# Altium schematic sheet ESP32xx.SchDoc
size OrCAD B
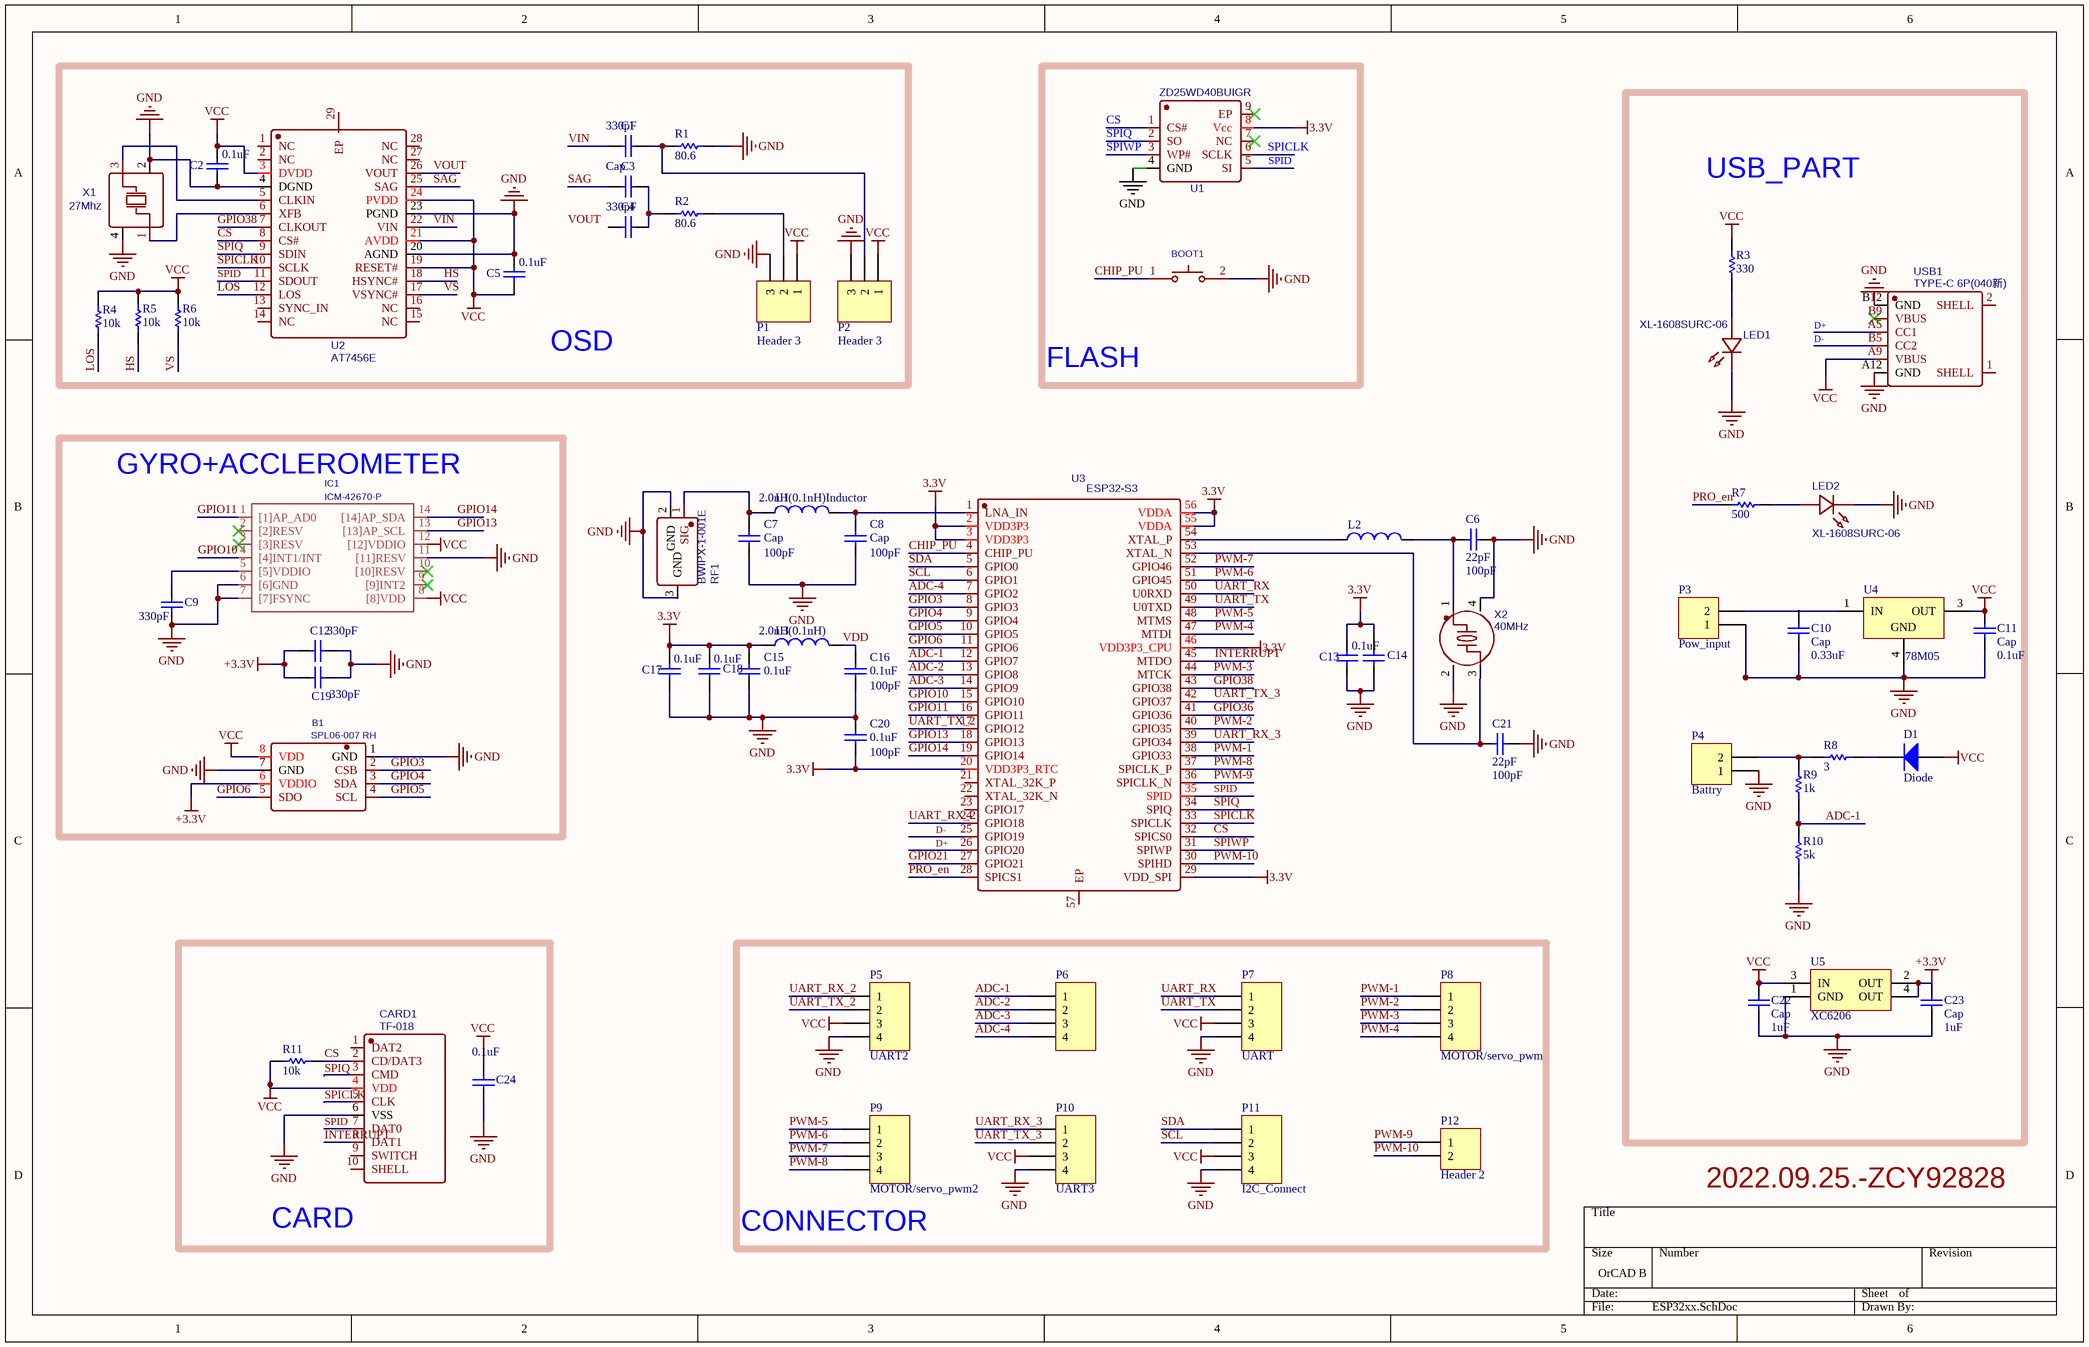
[diagram p0: ESP32xx.SchDoc]

## Parts
B1  SPL06-007 RH  [SPI060007]
BOOT1  BUTTON2  [BOOT]  (value not drawn)
C1  330pF  [INDIA_SOP]
C2  0.1uF  [INDIA_SOP]
C3  Cap  [INDIA_SOP]
C4  330pF  [INDIA_SOP]
C5  0.1uF  [INDIA_SOP]
C6  22pF  value 100pF  [INDIA_SOP]
C7  Cap  value 100pF  [INDIA_SOP]
C8  Cap  value 100pF  [INDIA_SOP]
C9  330pF  [INDIA_SOP]
C10  Cap  value 0.33uF  [INDIA_SOP]
C11  Cap  value 0.1uF  [INDIA_SOP]
C12  330pF  [INDIA_SOP]
C13  0.1uF  [INDIA_SOP]
C14  0.1uF  [INDIA_SOP]  (value not drawn)
C15  0.1uF  [INDIA_SOP]
C16  0.1uF  value 100pF  [INDIA_SOP]
C17  0.1uF  [INDIA_SOP]
C18  0.1uF  [INDIA_SOP]
C19  330pF  [INDIA_SOP]
C20  0.1uF  value 100pF  [INDIA_SOP]
C21  22pF  value 100pF  [INDIA_SOP]
C22  Cap  value 1uF  [INDIA_SOP]
C23  Cap  value 1uF  [INDIA_SOP]
C24  0.1uF  [INDIA_SOP]
CARD1  TF-018  [SD_CARD]
D1  Diode  [SMC]
IC1  ICM-42670-P  [ICM42670]
L1  2.0nH(0.1nH)Inductor  [0402-A]
L2  Inductor  [0402-A]  (value not drawn)
L3  2.0nH(0.1nH)  [0402-A]
LED1  XL-1608SURC-06  [LED]
LED2  XL-1608SURC-06  [LED]
P1  Header 3  [HDR1X3]
P2  Header 3  [HDR1X3]
P3  Pow_input  [HDR1X2]
P4  Battry  [HDR1X2]
P5  UART2  [HDR1X4]
P6  MOTOR/servo_pwm2  [HDR1X4]  (value not drawn)
P7  UART  [HDR1X4]
P8  MOTOR/servo_pwm  [HDR1X4]
P9  MOTOR/servo_pwm2  [HDR1X4]
P10  UART3  [HDR1X4]
P11  I2C_Connect  [HDR1X4]
P12  Header 2  [HDR1X2]
R1  80.6  [INDIA_SOP]
R2  80.6  [INDIA_SOP]
R3  330  [INDIA_SOP]
R4  10k  [INDIA_SOP]
R5  10k  [INDIA_SOP]
R6  10k  [INDIA_SOP]
R7  500  [INDIA_SOP]
R8  3  [INDIA_SOP]
R9  1k  [INDIA_SOP]
R10  5k  [INDIA_SOP]
R11  10k  [INDIA_SOP]
RF1  BWIPX-1-001E  [RF]
U1  ZD25WD40BUIGR  [25_FLASH]
U2  AT7456E  [AD7456]
U3  ESP32-S3  [ESP32]
U4  78M05  [TD03B_N]
U5  XC6206  [ZZ311]
USB1  TYPE-C 6P(040新)  [USB2.0]
X1  27Mhz  [CRYSTAL]
X2  40MHz  [CRYSTAL]

## Blocks framed on the sheet
OSD: C1-C5 P1 P2 R1 R2 R4-R6 U2 X1
FLASH: BOOT1 U1
USB_PART: C10 C11 C22 C23 D1 LED1 LED2 P3 P4 R3 R7-R10 U4 U5 USB1
GYRO+ACCLEROMETER: B1 C9 C12 C19 IC1
CARD: C24 CARD1 R11
CONNECTOR: P5-P12

## Nets
3.3V: C13.1 C14.1 C15.2 C17.1 C18.1 C20.1 L3.1 U1.8(Vcc) U3.2(VDD3P3) U3.3(VDD3P3) U3.20(VDD3P3_RTC) U3.29(VDD_SPI) U3.46(VDD3P3_CPU) U3.55(VDDA) U3.56(VDDA)
+3.3V: B1.6(VDDIO) C12.1 C19.1 U5.2(OUT) U5.4(OUT)
GND: B1.1(GND) B1.7(GND) BOOT1.2 C2.2 C5.1 C6.1 C7.1 C8.1 C9.1 C10.2 C11.2 C12.2 C13.2 C14.2 C15.1 C16.1 C17.2 C18.2 C19.2 C20.2 C21.1 C22.2 C23.2 C24.1 CARD1.6(VSS) IC1.6([6]GND) IC1.7([7]FSYNC) IC1.11([11]RESV) LED1.1(K) LED2.1(K) P1.3 P2.3 P3.1 P4.1 P5.4 P7.4 P10.4 P11.4 R1.1 R10.2 RF1.2(GND) RF1.3(GND) U1.4(GND) U2.4(DGND) U2.20(AGND) U2.23(PGND) U4.4(GND) U5.1(GND) USB1.A12(GND) USB1.B12(GND) X1.2(GND) X1.4(GND) X2.2(GND) X2.4(GND)
VCC: B1.8(VDD) C2.1 C5.2 C11.1 C22.1 C24.2 CARD1.4(VDD) D1.1(A) IC1.8([8]VDD) IC1.12([12]VDDIO) P1.1 P2.1 P5.3 P7.3 P10.3 P11.3 R3.2 R4.1 R5.1 R6.1 R11.2 U2.3(DVDD) U2.19(RESET#) U2.21(AVDD) U2.24(PVDD) U4.3(OUT) U5.3(IN) USB1.A9(VBUS)
ADC-1: P6.1 R9.2 R10.1 U3.12(GPIO7)
ADC-2: P6.2 U3.13(GPIO8)
ADC-3: P6.3 U3.14(GPIO9)
ADC-4: P6.4 U3.7(GPIO2)
CHIP_PU: BOOT1.1 U3.4(CHIP_PU)
CS: CARD1.2(CD/DAT3) R11.1 U1.1(CS#) U2.8(CS#) U3.32(SPICS0)
D+: U3.26(GPIO20) USB1.A5(CC1)
D-: U3.25(GPIO19) USB1.B5(CC2)
GPIO3: B1.2(CSB) U3.8(GPIO3)
GPIO4: B1.3(SDA) U3.9(GPIO4)
GPIO5: B1.4(SCL) U3.10(GPIO5)
GPIO6: B1.5(SDO) U3.11(GPIO6)
GPIO10: IC1.4([4]INT1/INT) U3.15(GPIO10)
GPIO11: IC1.1([1]AP_AD0) U3.16(GPIO11)
GPIO13: IC1.13([13]AP_SCL) U3.18(GPIO13)
GPIO14: IC1.14([14]AP_SDA) U3.19(GPIO14)
GPIO21: U3.27(GPIO21)
GPIO36: U3.41(GPIO36)
GPIO38: U3.43(GPIO38)
HS: R5.2 U2.18(HSYNC#)
INTERRUPT: CARD1.8(DAT1) U3.45(MTDO)
LOS: R4.2 U2.12(LOS)
PRO_en: R7.2 U3.28(SPICS1)
PWM-1: P8.1 U3.38(GPIO33)
PWM-2: P8.2 U3.40(GPIO35)
PWM-3: P8.3 U3.44(MTCK)
PWM-4: P8.4 U3.47(MTDI)
PWM-5: P9.1 U3.48(MTMS)
PWM-6: P9.2 U3.51(GPIO45)
PWM-7: P9.3 U3.52(GPIO46)
PWM-8: P9.4 U3.37(SPICLK_P)
PWM-9: P12.1 U3.36(SPICLK_N)
PWM-10: P12.2 U3.30(SPIHD)
SAG: C3.1 U2.25(SAG)
SCL: P11.2 U3.6(GPIO1)
SDA: P11.1 U3.5(GPIO0)
SPICLK: CARD1.5(CLK) U1.6(SCLK) U2.10(SCLK) U3.33(SPICLK)
SPID: CARD1.7(DAT0) U1.5(SI) U2.11(SDOUT) U3.35(SPID)
SPIQ: CARD1.3(CMD) U1.2(SO) U2.9(SDIN) U3.34(SPIQ)
SPIWP: U1.3(WP#) U3.31(SPIWP)
UART_RX: P7.1 U3.50(U0RXD)
UART_RX_2: P5.1 U3.24(GPIO18)
UART_RX_3: P10.1 U3.39(GPIO34)
UART_TX: P7.2 U3.49(U0TXD)
UART_TX_2: P5.2 U3.17(GPIO12)
UART_TX_3: P10.2 U3.42(GPIO37)
VDD: C16.2 L3.2
VIN: C1.1 U2.22(VIN)
VOUT: U2.26(VOUT)
VS: R6.2 U2.17(VSYNC#)
NetC1_2: C1.2 P2.2 R1.2
NetC3_2: C3.2 C4.2 R2.2
NetC6_2: C6.2 L2.2 X2.1
NetC7_2: C7.2 L1.1 RF1.1(SIG)
NetC8_2: C8.2 L1.2 U3.1(LNA_IN)
NetC9_2: C9.2 IC1.5([5]VDDIO)
NetC21_2: C21.2 U3.53(XTAL_N) X2.3
NetD1_2: D1.2(K) R8.1
NetL2_1: L2.1 U3.54(XTAL_P)
NetLED1_2: LED1.2(A) R3.1
NetLED2_2: LED2.2(A) R7.1
NetP1_2: P1.2 R2.1
NetP3_2: P3.2 U4.1(IN)
NetP4_2: P4.2 R8.2 R9.1
NetU2_5: U2.5(CLKIN) X1.3(OSC2)
NetU2_6: U2.6(XFB) X1.1(OSC1)

Not connected (* = marked no-connect by the designer): C4 1; C10 1; C23 1; CARD1 1(DAT2) 9(SWITCH) 10(SHELL); IC1 2([2]RESV)* 3([3]RESV)* 9([9]INT2)* 10([10]RESV)*; U1 7(NC)* 9(EP)*; U2 1(NC) 2(NC) 7(CLKOUT) 13(SYNC_IN) 14(NC) 15(NC) 16(NC) 27(NC) 28(NC) 29(EP); U3 21(XTAL_32K_P) 22(XTAL_32K_N) 23(GPIO17) 57(EP); USB1 1(SHELL) 2(SHELL) B9(VBUS)*

## Notes on the sheet
- 2022.09.25.-ZCY92828
- Labels drawn without touching a wire or pin: GPIO38, VOUT

## Library data of the parts
B1 = SPL06-007 RH: BOM_Manufacturer: Goertek; Contributor: RoyHendrie; SMT Type: Extend; BOM_Supplier: LCSC; BOM_Supplier Part: C233787; BOM_Manufacturer Part: SPL06-007; BOM_JLCPCB SMD: Yes; spicePre: U; spiceSymbolName: SPL06-007 RH
BOOT1 = BUTTON2: BOM_Manufacturer: null; Contributor: LCSC; BOM_Supplier: LCSC; BOM_Supplier Part: C9900005988; BOM_Manufacturer Part: BUTTON2; BOM_JLCPCB Part Class: Extended Part; spicePre: U; spiceSymbolName: BUTTON2
C1-C5 C9 C12-C15 C17-C19 C24 = Cap: Capacitor; Value: 100pF; Published: 8-Jun-2000; LatestRevisionDate: 17-Jul-2002; LatestRevisionNote: Re-released for DXP Platform.; PackageReference: RAD-0.3; Publisher: Altium Limited; PackageDescription: Radial Cap, Thru-Hole; 2 Leads; 0.3 in Pin Spacing
C6-C8 C10 C11 C16 C20-C23 = Cap: Capacitor; Published: 8-Jun-2000; LatestRevisionDate: 17-Jul-2002; LatestRevisionNote: Re-released for DXP Platform.; PackageReference: RAD-0.3; Publisher: Altium Limited; PackageDescription: Radial Cap, Thru-Hole; 2 Leads; 0.3 in Pin Spacing
CARD1 = TF-018: BOM_Manufacturer: 台湾汉博; Contributor: LCSC; BOM_Supplier: LCSC; BOM_Supplier Part: C961679; BOM_Manufacturer Part: TF-018; BOM_JLCPCB Part Class: Extended Part; spicePre: C; spiceSymbolName: TF-018
D1 = Diode: Default Diode; Published: 8-Jun-2000; LatestRevisionDate: 17-Jul-2002; LatestRevisionNote: Re-released for DXP Platform.; PackageVersion: Sep-1996; PackageReference: SMC; Publisher: Altium Limited; PackageDescription: DO-214-AB/SMC; 2 C-Bend Leads; Body 7.9 x 5.9 mm, inc. leads (LxW); Code_JEDEC: DO-214-AB
IC1 = ICM-42670-P: Contributor: ZatrepalekP; spicePre: I; spiceSymbolName: ICM-42670-P
L1-L3 = Inductor: Code_IEC: 1005; Value: 10mH; Published: 8-Jun-2000; LatestRevisionDate: 29-May-2009; LatestRevisionNote: IPC-7351 Footprint Added.; PackageReference: 0402-A; Publisher: Altium Limited; PackageDescription: Chip Inductor; Code_JEITA: 0402
LED1 LED2 = XL-1608SURC-06: BOM_Manufacturer: XINGLIGHT(成兴光); Contributor: LCSC; BOM_Supplier: LCSC; BOM_Supplier Part: C965799; BOM_Manufacturer Part: XL-1608SURC-06; BOM_JLCPCB Part Class: Extended Part; spicePre: L; spiceSymbolName: XL-1608SURC-06
P1 P2 = Header 3: Header, 3-Pin; LatestRevisionDate: 17-Jul-2002; LatestRevisionNote: Re-released for DXP Platform.; Publisher: Altium Limited
P3 P4 P12 = Header 2: Header, 2-Pin; LatestRevisionDate: 17-Jul-2002; LatestRevisionNote: Re-released for DXP Platform.; Publisher: Altium Limited
P5-P11 = Header 4: Header, 4-Pin; LatestRevisionDate: 17-Jul-2002; LatestRevisionNote: Re-released for DXP Platform.; Publisher: Altium Limited
R1-R11 = Res1: Resistor; Published: 8-Jun-2000; LatestRevisionDate: 17-Jul-2002; LatestRevisionNote: Re-released for DXP Platform.; PackageReference: AXIAL-0.3; Publisher: Altium Limited; PackageDescription: Axial Device, Thru-Hole; 2 Leads; 0.3 in Pin Spacing
RF1 = BWIPX-1-001E: BOM_Manufacturer: BAT WIRELESS(蝙蝠无线); Contributor: LCSC; BOM_Supplier: LCSC; BOM_Supplier Part: C496552; BOM_Manufacturer Part: BWIPX-1-001E; BOM_JLCPCB Part Class: Extended Part; spicePre: R; spiceSymbolName: BWIPX-1-001E
U1 = ZD25WD40BUIGR: BOM_Manufacturer: Zetta(澜智); Contributor: LCSC; BOM_Supplier: LCSC; BOM_Supplier Part: C2759917; BOM_Manufacturer Part: ZD25WD40BUIGR; BOM_JLCPCB Part Class: Extended Part; spicePre: U; spiceSymbolName: ZD25WD40BUIGR
U2 = AT7456E: BOM_Manufacturer: ZHONGKEWEI; BOM_Supplier: LCSC; BOM_Manufacturer Part: AT7456E; BOM_Supplier Part: C82351; BOM_JLCPCB Part Class: Extended Part; spicePre: U; spiceSymbolName: AT7456E
U3 = ESP32-S3: BOM_Manufacturer: ESPRESSIF 乐鑫; Contributor: LCSC; BOM_Supplier: LCSC; BOM_Supplier Part: C2913192; BOM_Manufacturer Part: ESP32-S3; BOM_JLCPCB Part Class: Extended Part; spicePre: U; spiceSymbolName: ESP32-S3
U4 = LM78M05CDT: 3-Terminal Positive Voltage Regulators; Manufacturer: National Semiconductor; CompType: LDO IC; PackageTopMarking: NSUZXYTT*LM78M05*CDT; PowerWise: N; Published: 4-Dec-2008; DatasheetVersion: Aug-2005; PackageVersion: revC, Apr-2003; PackageReference: TD03B; Publisher: Altium Limited; PackageDescription: TO252, Molded, Jedec, 6.8 x 6.10 x 2.30mm Body, 3 Lead, 2.28mm Pitch, Surface Mount; PartNumber: LM78M05CDT; RoHS: O; PinCount: 3; DigiKeyPartNumber: LM78M05CDT-ND; Code_JEDEC: TO-252-AA; ComponentLink1Description: LM78M05 Datasheet; ComponentLink1URL: http://www.national.com/ds/LM/LM78M05.pdf; ComponentLink2Description: LM78M05 Web Page; ComponentLink2URL: http://www.national.com/pf/LM/LM78M05.html; ComponentLink3Description: TD03B Package Page; ComponentLink3URL: http://www.national.com/packaging/folders/td03b.html
U5 = REG1117-3.3: 800mA and 1A Low Dropout Positive Regulator 2.85V, 3.3V, 5V, and Adjustable; Published: 8-Jun-2000; LatestRevisionDate: 17-Jul-2002; LatestRevisionNote: Re-released for DXP Platform.; DatasheetVersion: Sep-1997; PackageVersion: revC; PackageReference: ZZ311; Publisher: Altium Limited; PackageDescription: SOT-223/SC-73; 4 Leads; Body 6.7 x 7.3 mm, inc. leads (LxW max); ComponentLink1Description: Manufacturer Link; ComponentLink1URL: http://www.ti.com/; ComponentLink2Description: Datasheet; ComponentLink2URL: http://www-s.ti.com/sc/ds/REG1117.pdf
USB1 = TYPE-C 6P(040新): BOM_Manufacturer: SHOU HAN(首韩); Contributor: LCSC; BOM_Supplier: LCSC; BOM_Supplier Part: C2887422; BOM_Manufacturer Part: TYPE-C 6P(040新); BOM_JLCPCB Part Class: Extended Part; spicePre: U; spiceSymbolName: TYPE-C 6P(040新)
X1 = 27Mhz: BOM_Manufacturer: Zhejiang Abel Elec; BOM_Manufacturer Part: SMD-3225_4P27MHZ12PF10PPM-40~+85℃; nameAlias: Frequency; Contributor: LCSC; BOM_Supplier: LCSC; BOM_Supplier Part: C164057; BOM_JLCPCB Part Class: Extended Part; spicePre: X; spiceSymbolName: SMD-3225_4P27MHZ12PF10PPM-40~+85℃
X2 = 40MHz: BOM_Manufacturer: interquip(应达利); BOM_Manufacturer Part: 5YMA40000151SF40Q1; nameAlias: Frequency; Contributor: lcsc; BOM_Supplier: LCSC; BOM_Supplier Part: C3003278; spicePre: X; spiceSymbolName: 5YMA40000151SF40Q1